# EasyEDA Pro project 反相加法器.eprj

# Board 反相加法器
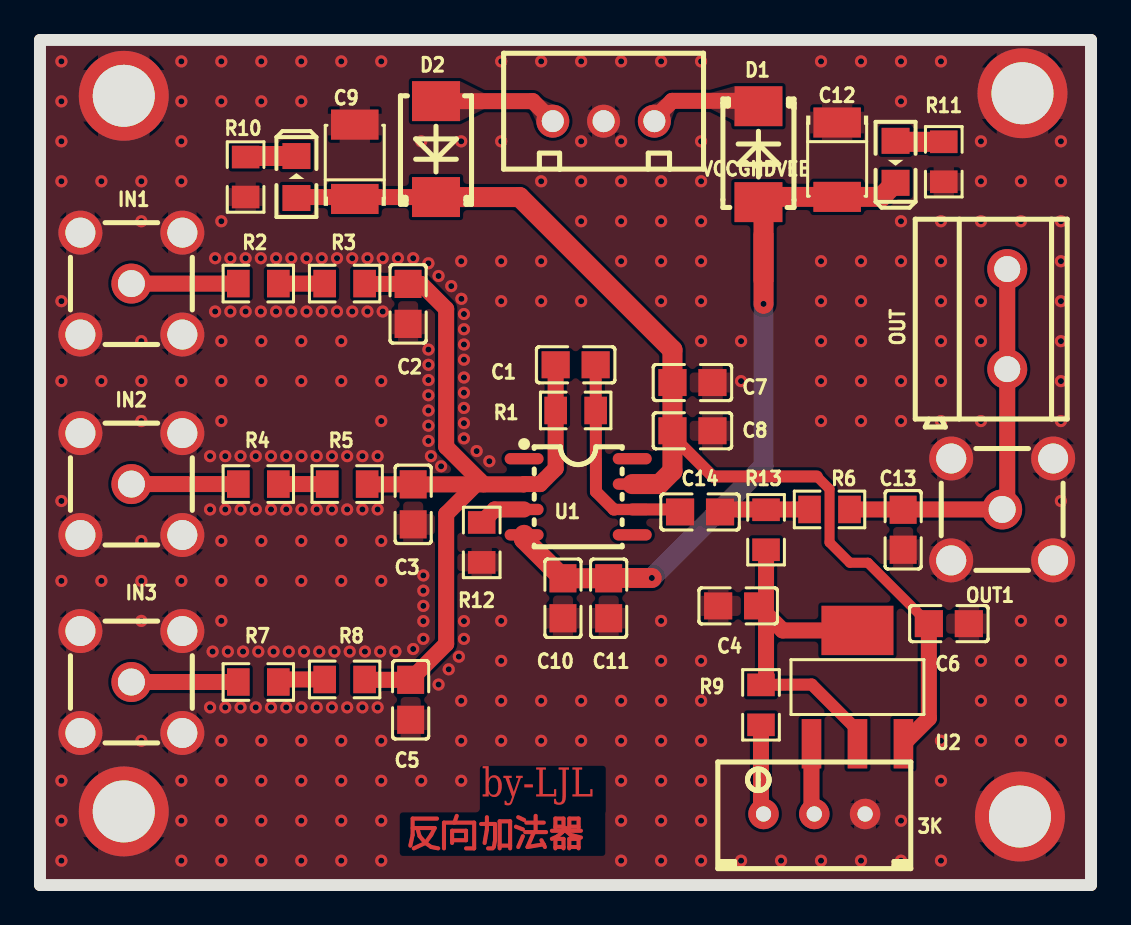
[diagram p0: board, top side]
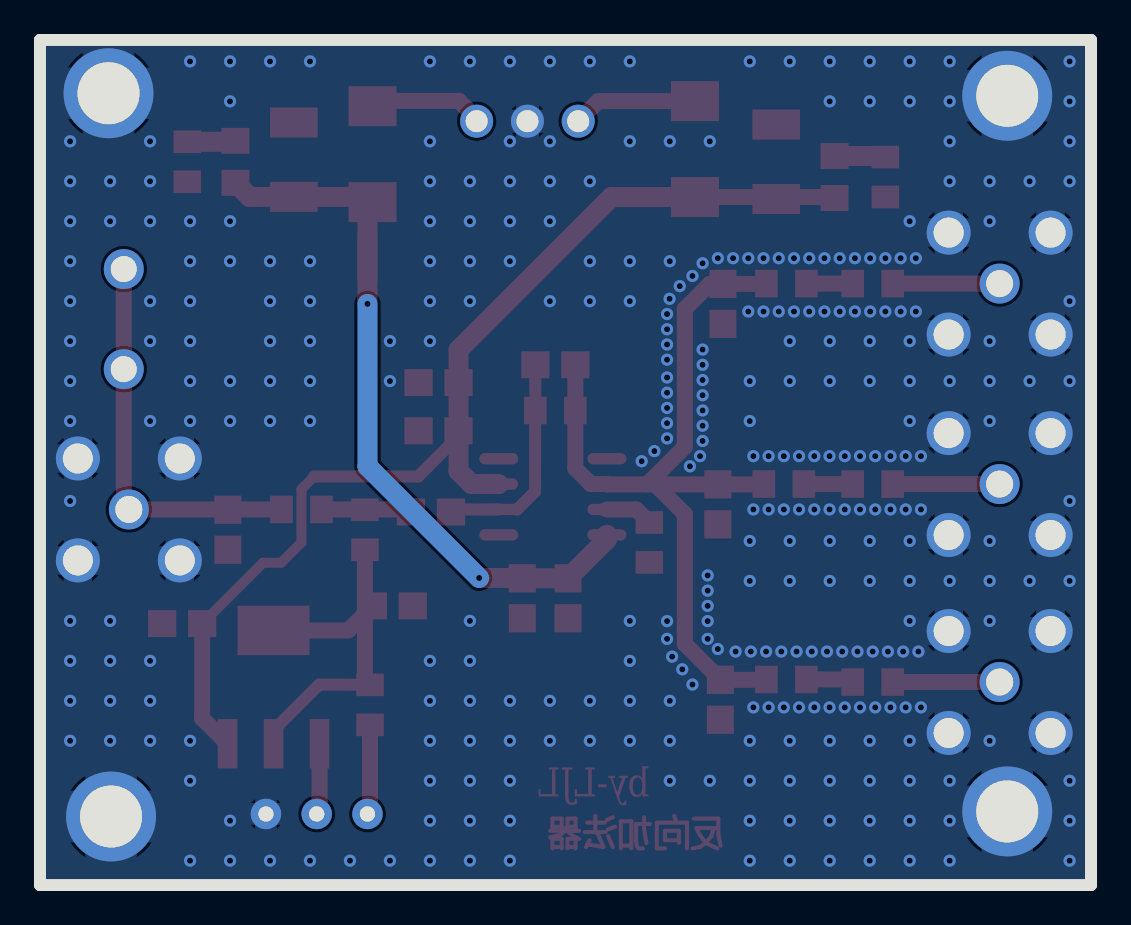
[diagram p1: board, bottom side, seen from below]

Outline 52.58 x 42.29 mm; copper layers: Top Layer, Bottom Layer. Coordinates in mm from the lower left corner of the outline.
Outline path: 0,42.29 52.58,42.29 52.58,0 0,0 0,42.29

## Design rules (mm)
via Default (default): diameter min 0.54, default 0.54, max 100.025; hole min 0.305, default 0.305, max 59.995
pour e3 uses gge15691
pour e102 uses gge15685

## Placement (name value [footprint] x y rotation side)
3K  R_3296W_US  [RES-ADJ-TH_3296W]  38.73 3.56 90 top
C1  100n  [C0805]  26.8 26.03 180 top
C2  NC  [C0805]  18.41 29.08 270 top
C3  NC  [C0805]  18.67 19.05 90 top
C4  10U  [C0805]  34.92 13.97 180 top
C5  NC  [C0805]  18.54 9.27 270 top
C6  10U  [C0805]  45.47 13.08 0 top
C7  100n  [C0805]  32.64 25.15 180 top
C8  10u  [C0805]  32.64 22.73 180 top
C9  47u  [CASE-B_3528]  15.75 36.19 90 top
C10  100n  [C0805]  26.16 14.35 270 top
C11  10u  [C0805]  28.45 14.35 270 top
C12  47u  [CASE-B_3528]  39.88 36.3 270 top
C13  NC  [C0805]  43.18 17.78 90 top
C14  100n  [C0805]  33.02 18.67 0 top
D1  SS34-SMB  [SMB_L4.4-W3.6-LS5.3-RD]  35.94 36.58 270 top
D2  SS34-SMB  [SMB_L4.4-W3.6-LS5.3-RD]  19.81 36.83 90 top
IN1  SMA-直插  [SMA-TH_BWSMA-KE-Z001]  4.57 30.1 0 top
IN2  SMA-直插  [SMA-TH_BWSMA-KE-Z001]  4.57 20.07 0 top
IN3  SMA-直插  [SMA-TH_BWSMA-KE-Z001]  4.57 10.16 90 top
LED1  LED-0805_G  [LED0805_GREEN]  12.83 35.43 90 top
LED2  LED-0805_G  [LED0805_GREEN]  42.8 36.19 270 top
OUT  -  [CONN-TH_2P-P5.00]  48.39 28.32 90 top
OUT1  SMA-直插  [SMA-TH_BWSMA-KE-Z001]  48.13 18.8 180 top
R1  500  [R0805]  26.8 23.75 0 top
R2  500  [R0805]  10.92 30.1 0 top
R3  500  [R0805]  15.24 30.1 0 top
R4  500  [R0805]  10.92 20.07 0 top
R5  500  [R0805]  15.37 20.07 0 top
R6  500  [R0805]  39.5 18.8 0 top
R7  500  [R0805]  10.92 10.16 0 top
R8  500  [R0805]  15.24 10.29 0 top
R9  1k  [R0805]  36.07 9.02 90 top
R10  3k  [R0805]  10.29 35.43 90 top
R11  3k  [R0805]  45.21 36.2 90 top
R12  500  [R0805]  22.1 17.14 90 top
R13  1k  [R0805]  36.32 17.78 90 top
T1  铜柱  [螺丝孔-3MM]  49.02 3.43 0 top
T2  铜柱  [螺丝孔-3MM]  4.19 39.5 180 top
T3  铜柱  [螺丝孔-3MM]  4.19 3.68 0 top
T4  铜柱  [螺丝孔-3MM]  49.15 39.62 0 top
U1  OPA227UA  [SOIC-8_L5.0-W4.0-P1.27-LS6.1-BL]  26.92 19.43 270 top
U2  AMS1117-1.5  [SOT-223-4_L6.5-W3.5-P2.30-LS7.0-BR]  40.89 9.91 270 top
VCCGNDVEE  HDR-F-2.54_1x3  [CONN-TH_XH2.54_3PIN]  28.19 38.23 180 top

## Footprints (pads in the part's own frame, mm; a bottom-side part is the same pattern mirrored in y, then rotated)
C0805
  rect 1.41x1.35 smd: 1(-1,0) 2(1,0)
CASE-B_3528
  rect 1.506x2.376 smd: 1(-1.861,0) 2(1.861,0)
CONN-TH_2P-P5.00
  round 2 hole 1.3: 1(-2.505,0) 2(2.505,0)
CONN-TH_XH2.54_3PIN
  round 1.65 hole 1.1: 1(-2.54,0) 2(0,0) 3(2.54,0)
LED0805_GREEN
  rect 1.3x1.399 smd: 1(-1.05,0) 2(1.05,0)
R0805
  rect 1.133x1.377 smd: 1(-1,0) 2(1,0)
RES-ADJ-TH_3296W
  round 1.524 hole 0.762: 1(0,2.54) 2(0,0) 3(0,-2.54)
SMA-TH_BWSMA-KE-Z001
  round 2 hole 1.35: 1(0,0)
  round 2.2 hole 1.5: 2(-2.55,2.55) 2(-2.55,-2.55) 2(2.55,2.55) 2(2.55,-2.55)
SMB_L4.4-W3.6-LS5.3-RD
  rect 2x2.4 smd: 1(-2.4,0) 2(2.4,0)
SOIC-8_L5.0-W4.0-P1.27-LS6.1-BL
  oval 0.569x1.95 smd: 1(-1.905,-2.705) 2(-0.635,-2.705) 3(0.635,-2.705) 4(1.905,-2.705) 5(1.905,2.705) 6(0.635,2.705) 7(-0.635,2.705) 8(-1.905,2.705)
SOT-223-4_L6.5-W3.5-P2.30-LS7.0-BR
  rect 2.47x0.98 smd: 1(2.835,-2.3) 2(2.835,0) 3(2.835,2.3)
  rect 2.47x3.6 smd: 4(-2.835,0)
螺丝孔-3MM
  round 4.5 hole 3.1: 1(0,0)

## Nets
GND: 3K.3 C2.2 C3.1 C4.2 C5.2 C6.2 C7.1 C8.1 C9.2 C10.2 C11.2 C12.1 C13.1 IN1.2 IN2.2 IN3.2 OUT1.2 R10.1 R11.1 R12.1 T1.1 T2.1 T3.1 T4.1 VCCGNDVEE.2
VCC: C6.1 C7.2 C8.2 C9.1 D2.1 LED1.1 U1.7 U2.3
VEE: C10.1 C11.1 C12.2 D1.2 LED2.2 U1.4
3K_1: 3K.1 R9.1
D1_1: D1.1 VCCGNDVEE.1
D2_2: D2.2 VCCGNDVEE.3
IN1_1: IN1.1 R2.1
IN2_1: IN2.1 R4.1
IN3_1: IN3.1 R7.1
OUT1_1: C13.2 OUT.1 OUT.2 OUT1.1 R6.2
R1_1: C1.2 C2.1 C3.2 C5.1 R1.1 R3.2 R5.2 R8.2 U1.2
R1_2: C1.1 C14.1 R1.2 U1.6
R3_1: R2.2 R3.1
R4_2: R4.2 R5.1
R6_1: C14.2 R6.1 R13.2
R7_2: R7.2 R8.1
R10_2: LED1.2 R10.2
R11_2: LED2.1 R11.2
U1_3: R12.2 U1.3
U2_1: 3K.2 U2.1
U2_2: C4.1 R9.2 R13.1 U2.2 U2.4

Pads without a net: U1 1 5 8

## Via types
v1: diameter 0.61, hole 0.305, Top Layer to Bottom Layer, 322 vias

## Routing (per net, layer and track width the routed paths; a pad name or vN(x,y) marks a point on that pad's centre or on a via; arc(x,y) is an arc through that point)
GND:
  vias: v1(1.07,41.22) v1(1.07,39.22) v1(1.07,37.22) v1(1.07,35.22) v1(1.07,29.22) v1(1.07,25.22) v1(1.07,19.22) v1(1.07,15.22) v1(1.07,5.22) v1(1.07,3.22) v1(1.07,1.22) v1(3.07,35.22) v1(3.07,25.22) v1(3.07,15.22) v1(5.07,35.22) v1(5.07,33.22) v1(5.07,27.22) v1(5.07,25.22) v1(5.07,23.22) v1(5.07,17.22) v1(5.07,15.22) v1(5.07,13.22) v1(5.07,7.22) v1(7.07,41.22) v1(7.07,39.22) v1(7.07,37.22) v1(7.07,35.22) v1(7.07,25.22) v1(7.07,15.22) v1(7.07,5.22) v1(7.07,3.22) v1(7.07,1.22) v1(8.51,21.46) v1(8.51,18.8) v1(8.51,8.89) v1(8.64,11.68) v1(8.76,31.37) v1(8.76,28.7) v1(9.07,41.22) v1(9.07,39.22) v1(9.07,33.22) v1(9.07,27.22) v1(9.07,25.22) v1(9.07,23.22) v1(9.07,17.22) v1(9.07,15.22) v1(9.07,13.22) v1(9.07,7.22) v1(9.07,5.22) v1(9.07,3.22) v1(9.07,1.22) v1(9.27,21.46) v1(9.27,18.8) v1(9.27,8.89) v1(9.4,11.68) v1(9.53,31.37) v1(9.53,28.7) v1(10.03,21.46) v1(10.03,18.8) v1(10.03,8.89) v1(10.16,11.68) v1(10.29,31.37) v1(10.29,28.7) v1(10.79,21.46) v1(10.79,18.8) v1(10.79,8.89) v1(10.92,11.68) v1(11.07,41.22) v1(11.07,39.22) v1(11.05,31.37) v1(11.05,28.7) v1(11.07,27.22) v1(11.07,25.22) v1(11.07,17.22) v1(11.07,15.22) v1(11.07,7.22) v1(11.07,5.22) v1(11.07,3.22) v1(11.07,1.22) v1(11.56,21.46) v1(11.56,18.8) v1(11.56,8.89) v1(11.68,11.68) v1(11.81,31.37) v1(11.81,28.7) v1(12.32,21.46) v1(12.32,18.8) v1(12.32,8.89) v1(12.45,11.68) v1(12.57,31.37) v1(12.57,28.7) v1(13.07,41.22) v1(13.07,39.22) v1(13.07,27.22) v1(13.07,25.22) v1(13.08,21.46) v1(13.08,18.8) v1(13.07,17.22) v1(13.07,15.22) v1(13.08,8.89) v1(13.07,7.22) v1(13.07,5.22) v1(13.07,3.22) v1(13.07,1.22) v1(13.21,11.68) v1(13.34,31.37) v1(13.34,28.7) v1(13.84,21.46) v1(13.84,18.8) v1(13.84,8.89) v1(13.97,11.68) v1(14.1,31.37) v1(14.1,28.7) v1(14.6,21.46) v1(14.6,18.8) v1(14.6,8.89) v1(14.73,11.68) v1(14.86,31.37) v1(14.86,28.7) v1(15.07,41.22) v1(15.07,27.22) v1(15.07,25.22) v1(15.07,17.22) v1(15.07,15.22) v1(15.07,7.22) v1(15.07,5.22) v1(15.07,3.22) v1(15.07,1.22) v1(15.37,21.46) v1(15.37,18.8) v1(15.37,8.89) v1(15.49,11.68) v1(15.62,31.37) v1(15.62,28.7) v1(16.13,21.46) v1(16.13,18.8) v1(16.13,8.89) v1(16.26,11.68) v1(16.38,31.37) v1(16.38,28.7) v1(16.89,21.46) v1(16.89,18.8) v1(16.89,8.89) v1(17.02,11.68) v1(17.07,41.22) v1(17.07,25.22) v1(17.07,23.22) v1(17.07,17.22) v1(17.07,15.22) v1(17.07,7.22) v1(17.07,5.22) v1(17.07,3.22) v1(17.07,1.22) v1(17.15,31.37) v1(17.15,28.7) v1(17.78,11.68) v1(17.91,31.37) v1(18.67,31.37) v1(18.67,11.81) v1(19.07,37.22) v1(19.07,5.22) v1(19.18,15.49) v1(19.18,14.73) v1(19.18,13.97) v1(19.18,13.21) v1(19.18,12.32) v1(19.43,31.11) v1(19.43,26.8) v1(19.43,26.03) v1(19.43,25.27) v1(19.43,24.51) v1(19.43,23.75) v1(19.43,22.99) v1(19.43,22.23) v1(19.56,21.46) v1(19.94,30.48) v1(19.94,10.03) v1(20.07,20.95) v1(20.45,10.8) v1(20.57,29.97) v1(20.95,11.43) v1(21.07,37.22) v1(21.07,31.22) v1(21.08,29.34) v1(21.07,9.22) v1(21.07,7.22) v1(21.07,5.22) v1(21.21,28.58) v1(21.21,27.81) v1(21.21,27.05) v1(21.21,26.29) v1(21.21,25.4) v1(21.21,24.64) v1(21.21,23.88) v1(21.21,23.11) v1(21.21,22.35) v1(21.21,13.21) v1(21.21,12.32) v1(21.84,21.72) v1(22.48,21.21) v1(23.07,41.22) v1(23.07,37.22) v1(23.07,31.22) v1(23.07,29.22) v1(23.07,13.22) v1(23.07,11.22) v1(23.07,9.22) v1(23.07,7.22) v1(25.07,41.22) v1(25.07,35.22) v1(25.07,31.22) v1(25.07,29.22) v1(25.07,9.22) v1(25.07,7.22) v1(27.07,41.22) v1(27.07,37.22) v1(27.07,35.22) v1(27.07,33.22) v1(27.07,29.22) v1(27.07,9.22) v1(27.07,7.22) v1(29.07,41.22) v1(29.07,37.22) v1(29.07,35.22) v1(29.07,33.22) v1(29.07,31.22) v1(29.07,9.22) v1(29.07,7.22) v1(29.07,5.22) v1(29.07,3.22) v1(29.07,1.22) v1(31.07,41.22) v1(31.07,35.22) v1(31.07,33.22) v1(31.07,31.22) v1(31.07,29.22) v1(31.07,13.22) v1(31.07,11.22) v1(31.07,9.22) v1(31.07,7.22) v1(31.07,5.22) v1(31.07,3.22) v1(31.07,1.22) v1(33.07,41.22) v1(33.07,37.22) v1(33.07,35.22) v1(33.07,33.22) v1(33.07,31.22) v1(33.07,29.22) v1(33.07,27.22) v1(33.07,11.22) v1(33.07,9.22) v1(33.07,7.22) v1(33.07,5.22) v1(33.07,3.22) v1(33.07,1.22) v1(35.07,27.22) v1(35.07,25.22) v1(35.07,1.22) v1(37.07,1.22) v1(39.07,41.22) v1(39.07,31.22) v1(39.07,29.22) v1(39.07,27.22) v1(39.07,25.22) v1(39.07,23.22) v1(39.07,1.22) v1(41.07,41.22) v1(41.07,31.22) v1(41.07,29.22) v1(41.07,27.22) v1(41.07,25.22) v1(41.07,23.22) v1(41.07,1.22) v1(43.07,41.22) v1(43.07,39.22) v1(43.07,33.22) v1(43.07,31.22) v1(43.07,25.22) v1(43.07,23.22) v1(43.07,3.22) v1(43.07,1.22) v1(45.07,41.22) v1(45.07,33.22) v1(45.07,31.22) v1(45.07,29.22) v1(45.07,27.22) v1(45.07,25.22) v1(45.07,23.22) v1(45.07,7.22) v1(45.07,5.22) v1(45.07,1.22) v1(47.07,37.22) v1(47.07,35.22) v1(47.07,33.22) v1(47.07,29.22) v1(47.07,27.22) v1(47.07,23.22) v1(47.07,11.22) v1(47.07,9.22) v1(47.07,7.22) v1(49.07,35.22) v1(49.07,33.22) v1(49.07,13.22) v1(49.07,11.22) v1(49.07,9.22) v1(49.07,7.22) v1(51.07,37.22) v1(51.07,35.22) v1(51.07,33.22) v1(51.07,31.22) v1(51.07,29.22) v1(51.07,27.22) v1(51.07,25.22) v1(51.07,23.22) v1(51.07,19.22) v1(51.07,13.22) v1(51.07,11.22) v1(51.07,9.22) v1(51.07,7.22)
VCC: length 55.4
  Top Layer w0.5: 38.86,20.45 39.5,19.81 39.5,17.14 40.51,16.13 41.42,16.13 C6.1
  Top Layer w0.6: 38.86,20.45 33.66,20.45 31.64,22.46 31.64,22.73
  Top Layer w0.8: 12.83,34.38 12.87,34.43 D2.1 ; C6.1 44.47,8.34 43.19,7.07
  Top Layer w1: D2.1 23.99,34.43 31.64,26.78 C8.2 31.64,20.72 30.99,20.06 U1.7
VEE: length 41.5
  Top Layer w0.8: D1.2 36.19,33.92 36.19,31.13
  Top Layer w1: D1.2 36.2,34.44 C12.2 42.09,34.44 42.8,35.14 ; D1.2 35.81,34.05 ; D1.2 36.19,33.92 36.19,30.28 ; 24.22,17.53 24.22,17.3 C10.1 C11.1 28.46,15.37 v1(30.61,15.37) ; 36.19,32.52 v1(36.19,29.08)
  Bottom Layer w1: v1(36.19,29.08) 36.19,20.95 v1(30.61,15.37)
3K_1: length 4.5
  Top Layer w0.8: 3K.1 36.07,3.68 R9.1
D1_1: length 6
  Top Layer w0.8: VCCGNDVEE.1 30.73,38.35 31.62,39.24 35.94,39.24 D1.1
D2_2: length 6.3
  Top Layer w0.8: 19.81,39.23 24.65,39.23 VCCGNDVEE.3
IN1_1: length 5.3
  Top Layer w0.8: IN1.1 R2.1
IN2_1: length 5.3
  Top Layer w0.8: IN2.1 R4.1
IN3_1: length 5.3
  Top Layer w0.8: IN3.1 R7.1
OUT1_1: length 19.8
  Top Layer w0.8: R6.2 OUT1.1 48.39,19.05 OUT.2
R1_1: length 42.8
  Top Layer w0.8: 18.41,30.08 19.06,30.08 20.32,28.83 20.32,21.93 22.2,20.05 ; R8.2 16.26,10.27 C5.1 18.54,10.29 20.32,12.06 20.32,18.57 22,20.24 ; C1.2 R1.1 25.8,20.84 25.02,20.06 24.22,20.06 24.2,20.05 C3.2 16.38,20.05 R5.2 ; R3.2 16.26,30.08 C2.1
R1_2: length 10.1
  Top Layer w0.6: C14.1 31.89,18.8 U1.6 ; 28.78,18.8 28.7,18.8 27.81,19.69 C1.1
R3_1: length 2.3
  Top Layer w0.8: R2.2 R3.1
R4_2: length 2.4
  Top Layer w0.8: R4.2 R5.1
R6_1: length 4.3
  Top Layer w0.8: R6.1 34.18,18.8 34.16,18.78
R7_2: length 2.4
  Top Layer w0.8: R7.2 12.05,10.29 R8.1
R10_2: length 2.6
  Top Layer w1: 12.83,36.48 10.34,36.48 R10.2
R11_2: length 2.4
  Top Layer w1: 42.8,37.25 42.85,37.2 R11.2
U1_3: length 2.4
  Top Layer w0.8: R12.2 22.75,18.8 24.22,18.8
U2_1: length 3.6
  Top Layer w0.8: 3K.2 38.59,3.7 38.59,7.07
U2_2: length 18.8
  Top Layer w0.6: R9.2 38.61,10.03 40.89,7.75 U2.2
  Top Layer w0.8: R13.1 36.32,10.27 R9.2 ; C4.1 37.15,12.74 U2.4

## Copper pours and planes (outline as drawn; the poured copper is in the pictures)
GND on Top Layer: -0.13,42.48 55.88,42.48 55.88,-4.13 -0.51,-4.13 -0.51,-3.87
GND on Bottom Layer: -0.25,42.48 56.51,42.61 56.51,-6.03 -0.64,-6.03 -0.64,-3.37

Small or netless copper shapes (teardrops, artwork), in the pictures only: 4 on Top Layer

## Text on the board
Top Layer: 反向加法器 | by-LJL
